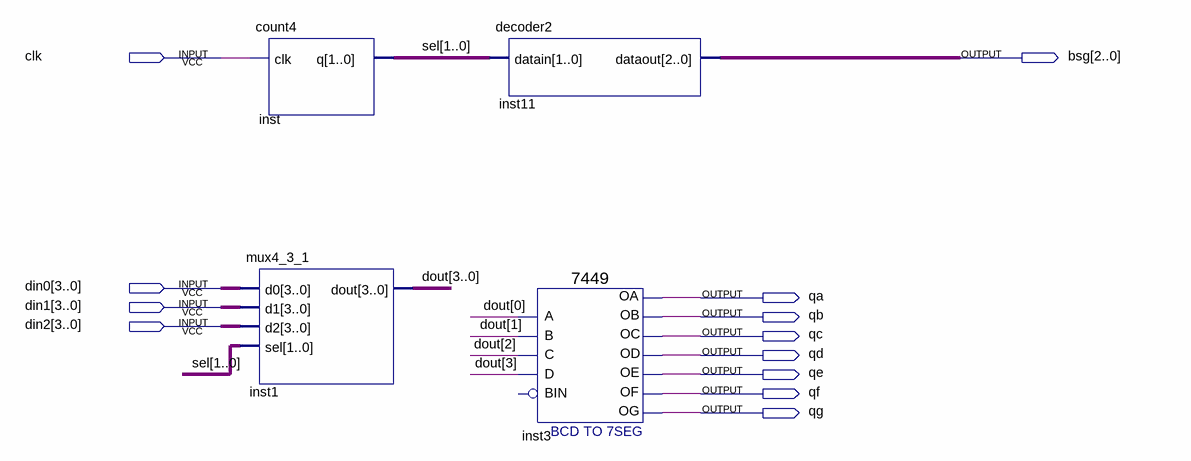
[diagram p0: schematic sheet]
// Quartus schematic scan_ledt.bdf as structural Verilog: 4 symbols, 12 pins
module scan_ledt (
  input  clk,
  input  [3:0] din0,
  input  [3:0] din1,
  input  [3:0] din2,
  output [2:0] bsg,
  output qa,
  output qb,
  output qc,
  output qd,
  output qe,
  output qf,
  output qg
);

  wire [1:0] sel;
  wire [3:0] dout;

  count4 inst (.clk(clk), .q(sel));
  mux4_3_1 inst1 (.d0(din0), .d1(din1), .d2(din2), .sel(sel), .dout(dout));
  decoder2 inst11 (.datain(sel), .dataout(bsg));
  \7449  inst3 (
    .A(dout[0]), .C(dout[2]), .B(dout[1]), .D(dout[3]), .OC(qc), .OD(qd), .OF(qf), .OG(qg), .OB(qb), .OA(qa),
    .OE(qe));  // open: BIN
endmodule
